# Altium schematic sheet IO_FMU_REV_1A.SchDoc: Pixhawk_mini_8L.sch
size A4; Date: 18/08/2014 1:53:23 PM; DrawnBy: Philip Rowse; SheetNumber: 7; SheetTotal: 10
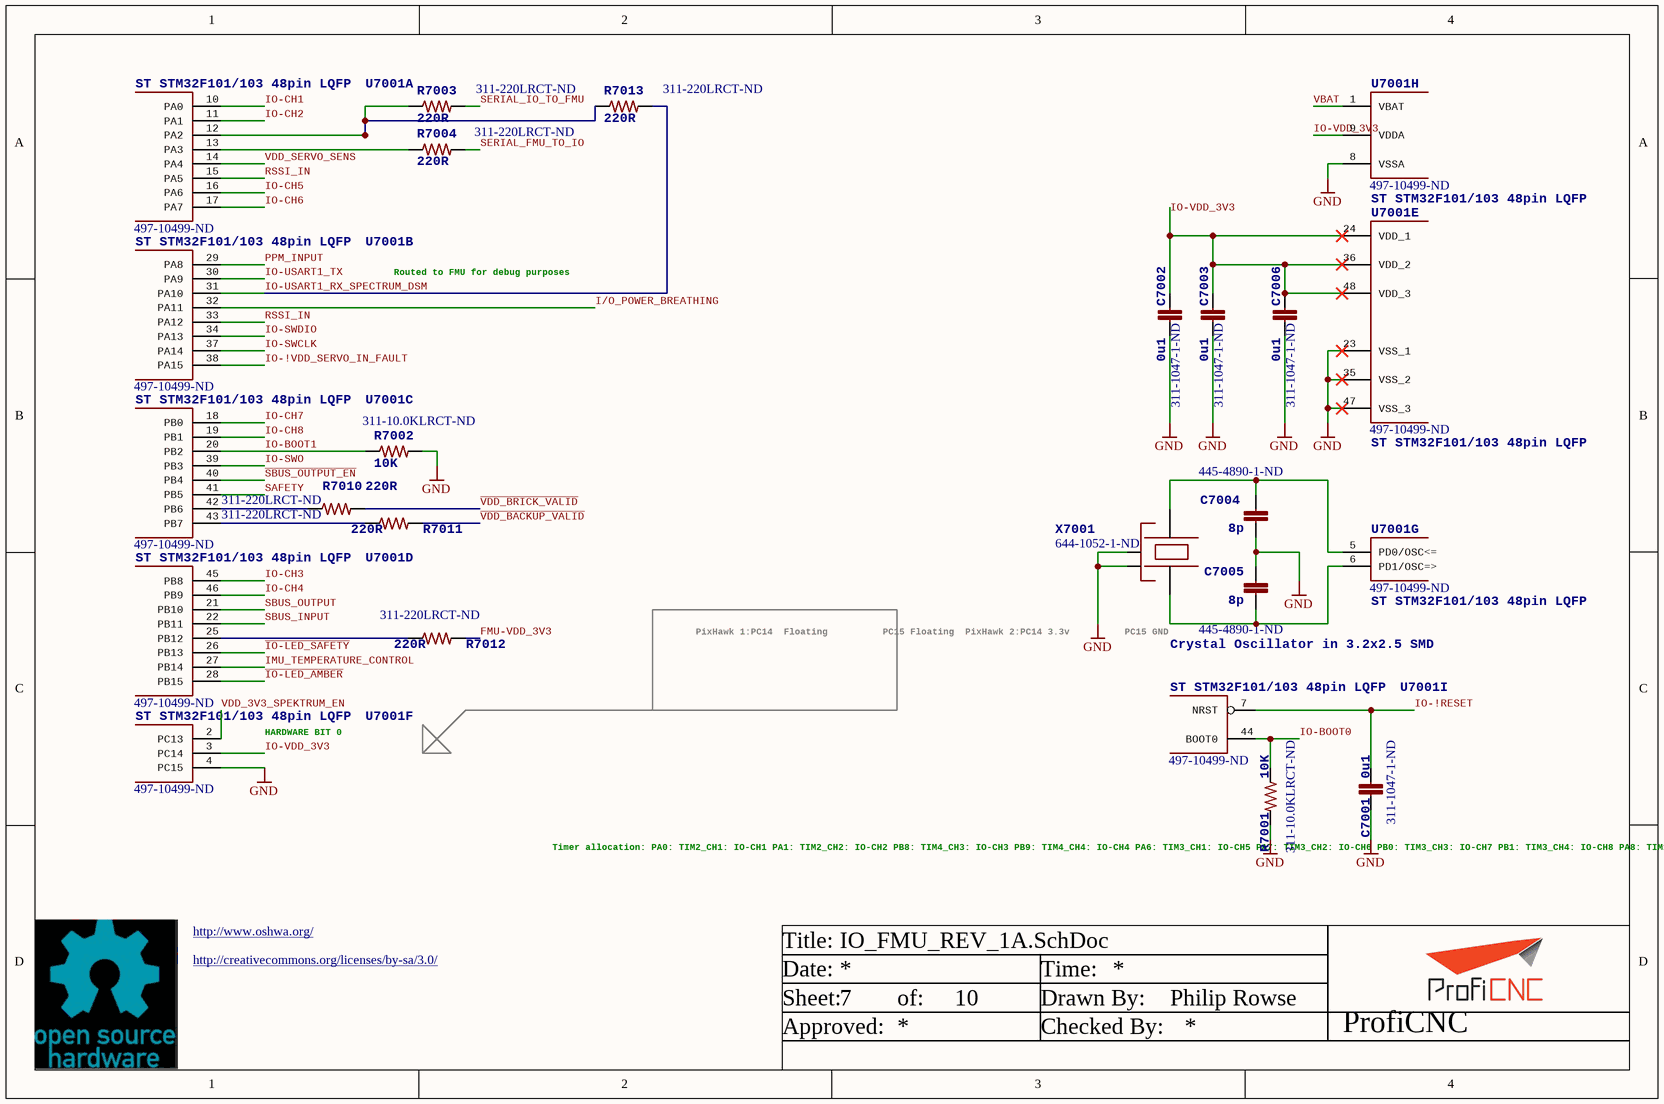
[diagram p0: IO_FMU_REV_1A.SchDoc]

## Parts
C7001  0u1  Supplier Part Number 1: 311-1047-1-ND  [0402-CAP]
C7002  0u1  Supplier Part Number 1: 311-1047-1-ND  [0402-CAP]
C7003  0u1  Supplier Part Number 1: 311-1047-1-ND  [0402-CAP]
C7004  8p  Supplier Part Number 1: 445-4890-1-ND  [0402-CAP]
C7005  8p  Supplier Part Number 1: 445-4890-1-ND  [0402-CAP]
C7006  0u1  Supplier Part Number 1: 311-1047-1-ND  [0402-CAP]
R7001  10K  Supplier Part Number 1: 311-10.0KLRCT-ND  [0402-RES]
R7002  10K  Supplier Part Number 1: 311-10.0KLRCT-ND  [0402-RES]
R7003  220R  Supplier Part Number 1: 311-220LRCT-ND  [0402-RES]
R7004  220R  Supplier Part Number 1: 311-220LRCT-ND  [0402-RES]
R7010  220R  Supplier Part Number 1: 311-220LRCT-ND  [0402-RES]
R7011  220R  Supplier Part Number 1: 311-220LRCT-ND  [0402-RES]
R7012  220R  Supplier Part Number 1: 311-220LRCT-ND  [0402-RES]
R7013  220R  Supplier Part Number 1: 311-220LRCT-ND  [0402-RES]
U7001  ST STM32F101/103 48pin LQFP  Supplier Part Number 1: 497-10499-ND  [TQFP48]  (parts A,B,C,D,E,F,G,H,I of 9)
X7001  Crystal Oscillator in 3.2x2.5 SMD  Supplier Part Number 1: 644-1052-1-ND  [OSCILLATOR-3.2X2.5]

## Nets
GND: C7001.P$1 C7002.P$2 C7003.P$2 C7004.P$2 C7005.P$1 C7006.P$2 R7001.P$2 R7002.P$2 U7001.4(PC15) U7001.8(VSSA) U7001.23(VSS_1) U7001.35(VSS_2) U7001.47(VSS_3) X7001.2(NC_2) X7001.4(NC_4)
FMU-VDD_3V3: R7012.P$2
I/O_POWER_BREATHING: U7001.32(PA11)
~{IO-LED_AMBER}: U7001.28(PB15)
~{IO-LED_SAFETY}: U7001.26(PB13)
IMU_TEMPERATURE_CONTROL: U7001.27(PB14)
IO-!RESET: C7001.P$2 U7001.7(NRST)
IO-!VDD_SERVO_IN_FAULT: U7001.38(PA15)
IO-BOOT0: R7001.P$1 U7001.44(BOOT0)
IO-BOOT1: R7002.P$1 U7001.20(PB2)
IO-CH1: U7001.10(PA0)
IO-CH2: U7001.11(PA1)
IO-CH3: U7001.45(PB8)
IO-CH4: U7001.46(PB9)
IO-CH5: U7001.16(PA6)
IO-CH6: U7001.17(PA7)
IO-CH7: U7001.18(PB0)
IO-CH8: U7001.19(PB1)
IO-SWCLK: U7001.37(PA14)
IO-SWDIO: U7001.34(PA13)
IO-SWO: U7001.39(PB3)
IO-USART1_RX_SPECTRUM_DSM: R7013.P$2 U7001.31(PA10)
IO-USART1_TX: U7001.30(PA9)
IO-VDD_3V3: C7002.P$1 C7003.P$1 C7006.P$1 U7001.3(PC14) U7001.9(VDDA) U7001.24(VDD_1) U7001.36(VDD_2) U7001.48(VDD_3)
PPM_INPUT: U7001.29(PA8)
RSSI_IN: U7001.15(PA5) U7001.33(PA12)
~{SBUS_OUTPUT_EN}: U7001.40(PB4)
SAFETY: U7001.41(PB5)
SBUS_INPUT: U7001.22(PB11)
SBUS_OUTPUT: U7001.21(PB10)
SERIAL_FMU_TO_IO: R7004.P$2
SERIAL_IO_TO_FMU: R7003.P$2
~{VDD_BACKUP_VALID}: R7011.P$2
~{VDD_BRICK_VALID}: R7010.P$2
VBAT: U7001.1(VBAT)
VDD_3V3_SPEKTRUM_EN: U7001.2(PC13)
VDD_SERVO_SENS: U7001.14(PA4)
NetC7004_P$1: C7004.P$1 U7001.5(PD0/OSC<=) X7001.3
NetC7005_P$2: C7005.P$2 U7001.6(PD1/OSC=>) X7001.1
NetR7003_P$1: R7003.P$1 R7013.P$1 U7001.12(PA2)
NetR7004_P$1: R7004.P$1 U7001.13(PA3)
NetR7010_P$1: R7010.P$1 U7001.42(PB6)
NetR7011_P$1: R7011.P$1 U7001.43(PB7)
NetR7012_P$1: R7012.P$1 U7001.25(PB12)

## Notes on the sheet
- Routed to FMU for debug purposes
- PixHawk 1:PC14  Floating
  PC15 Floating
  PixHawk 2:PC14 3.3v
  PC15 GND
- HARDWARE BIT 0
- Timer allocation:
  PA0: TIM2_CH1: IO-CH1
  PA1: TIM2_CH2: IO-CH2
  PB8: TIM4_CH3: IO-CH3
  PB9: TIM4_CH4: IO-CH4
  PA6: TIM3_CH1: IO-CH5
  PA7: TIM3_CH2: IO-CH6
  PB0: TIM3_CH3: IO-CH7
  PB1: TIM3_CH4: IO-CH8
  PA8: TIM1_CH1: PPM_IN
  PA11: TIM1_CH4: RSSI_IN
- http://www.oshwa.org/
- http://creativecommons.org/licenses/by-sa/3.0/
- Title:
- Date:
- Time:
- Sheet:
- Approved:
- of:
- Drawn By:
- Checked By:
- ProfiCNC

## Library data of the parts
C7001-C7003 C7006 = CAP0402: CAP CER 0.1UF 16V Y5V 0402; PARTNO: CC0402ZRY5V7BB104; 3DR_PARTNO: ECM0700; Supplier 1: Digi-Key; Value: 0u1
C7004 C7005 = CAP0402: CAP CER 8PF 50V C0G 0402; PARTNO: C1005C0G1H080C; 3DR_PARTNO: ECM0710; Supplier 1: Digi-Key; Value: 8p
R7001 R7002 = RESISTOR0402-RES: RES 10K OHM 1/16W 1% 0402 SMD; PARTNO: RC0402FR-0710KL; 3DR_PARTNO: ECM0800; Supplier 1: Digi-Key; Value: 10K
R7003 R7004 R7010-R7013 = RESISTOR0402-RES: RES 220 OHM 1/16W 1% 0402 SMD; PARTNO: RC0402FR-07220RL; 3DR_PARTNO: ECM0821; Supplier 1: Digi-Key; Value: 220R
U7001 = STM32F10XCXT6: MCU 32BIT ARM 64K FLASH 48LQFP; 3DR_PARTNO: EMC0842; Supplier 1: Digi-Key
X7001 = OSCILLATOR-3.2X2.5: CRYSTAL 24MHZ 8PF SMD; 3DR_PARTNO: ECM0708; PARTNO: NX3225SA-24.000MHZ-STD-CSR-1; Supplier 1: Digi-Key; Value: 24MHz